# EAGLE design modul_przekaznika (EAGLE 7.7.0)
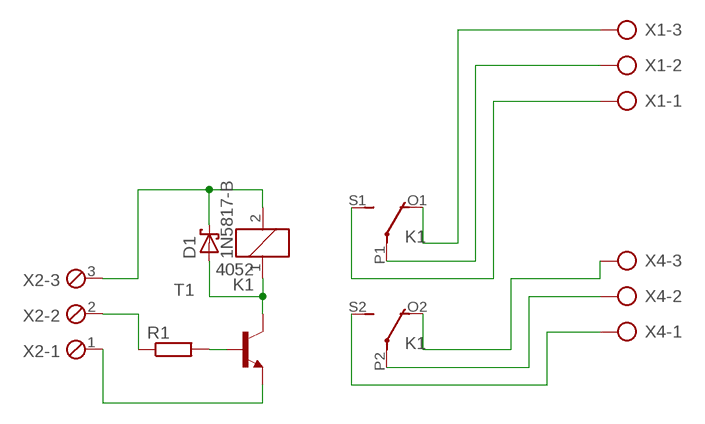
[diagram p0: schematic, sheet 1]

## Parts
D1  1N5817-B  [DO41-7.6]
K1  4052  [F4052]
R1  R-EU_M1206  [M1206]
T1  BC548-NPN-TO92-CBE  [TO92-CBE]
X1  AK500/3  [AK500/3]
X2  MPT3  [3POL254]
X4  AK500/3  [AK500/3]

## Nets
N$1: D1.A K1.1 T1.C
N$2: D1.C K1.2 X2.3
N$3: K1.S2(3:S) X4.1
N$4: K1.P2(3:P) X4.2
N$5: K1.O2(3:O) X4.3
N$6: K1.S1(2:S) X1.1
N$7: K1.P1(2:P) X1.2
N$8: K1.O1(2:O) X1.3
N$9: T1.E X2.1
N$10: R1.1 X2.2
N$11: R1.2 T1.B

## Library data of the parts
D1 = diode:1N581*: 1.0A SCHOTTKY BARRIER RECTIFIER Source: http://www.diodes.com/datasheets/ds23001.pdf
K1 = relay:4052: RELAY 2 x switch, Finder; OC_FARNELL: unknown; OC_NEWARK: unknown
R1 = rcl:R-EU_: RESISTOR, European symbol
T1 = transistor:*-NPN-: NPN Transistror BF959 corrected 2008.03.06
X1 X4 = con-ptr500:AK500/3: CONNECTOR; OC_FARNELL: unknown; OC_NEWARK: unknown
X2 = con-phoenix-254:MPT3: PHOENIX CONNECTOR; OC_FARNELL: unknown; OC_NEWARK: unknown

## Board
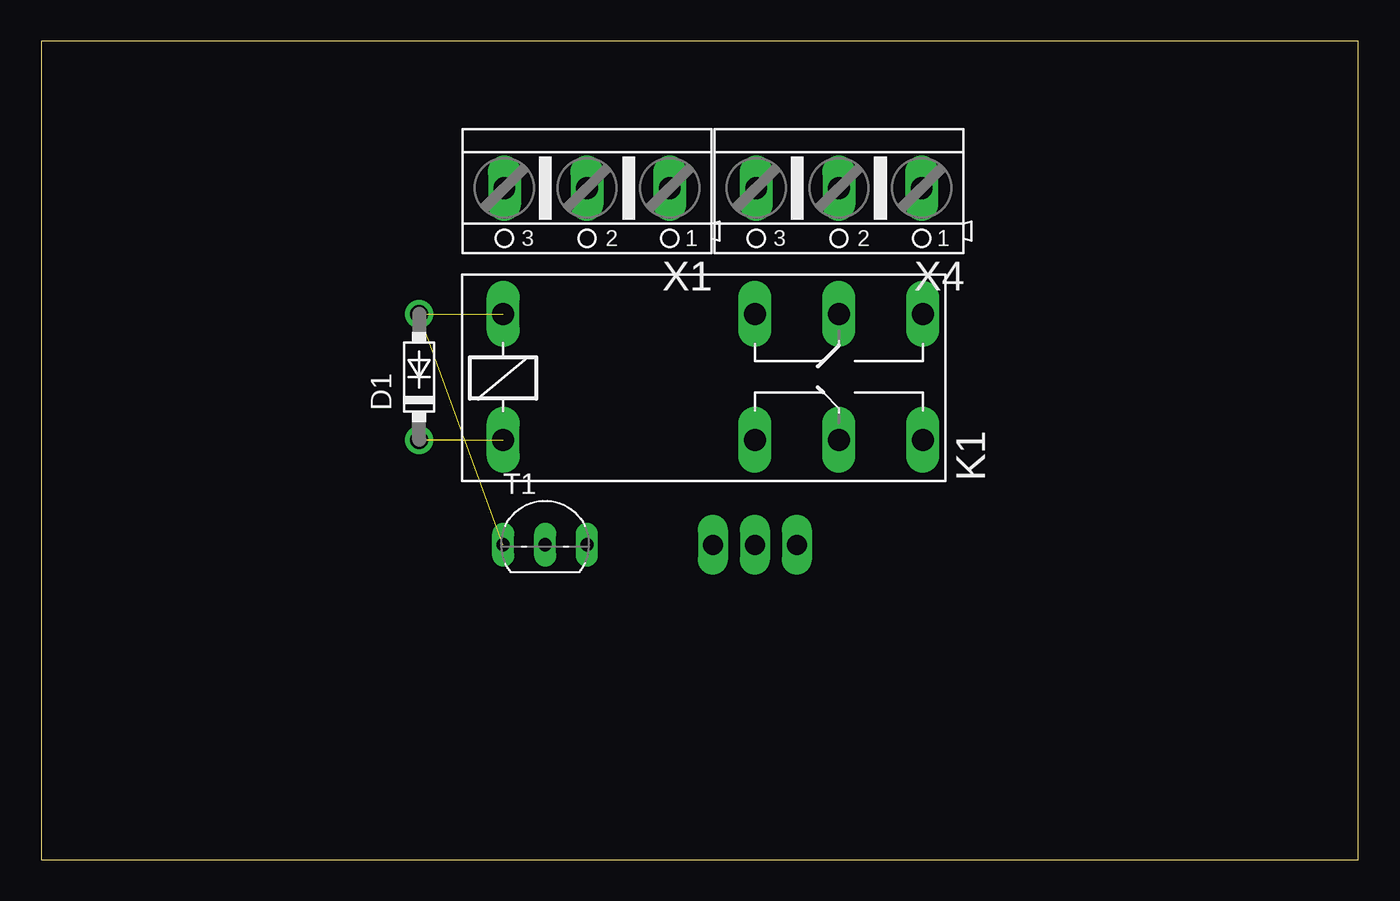
[diagram p1: board, top side]
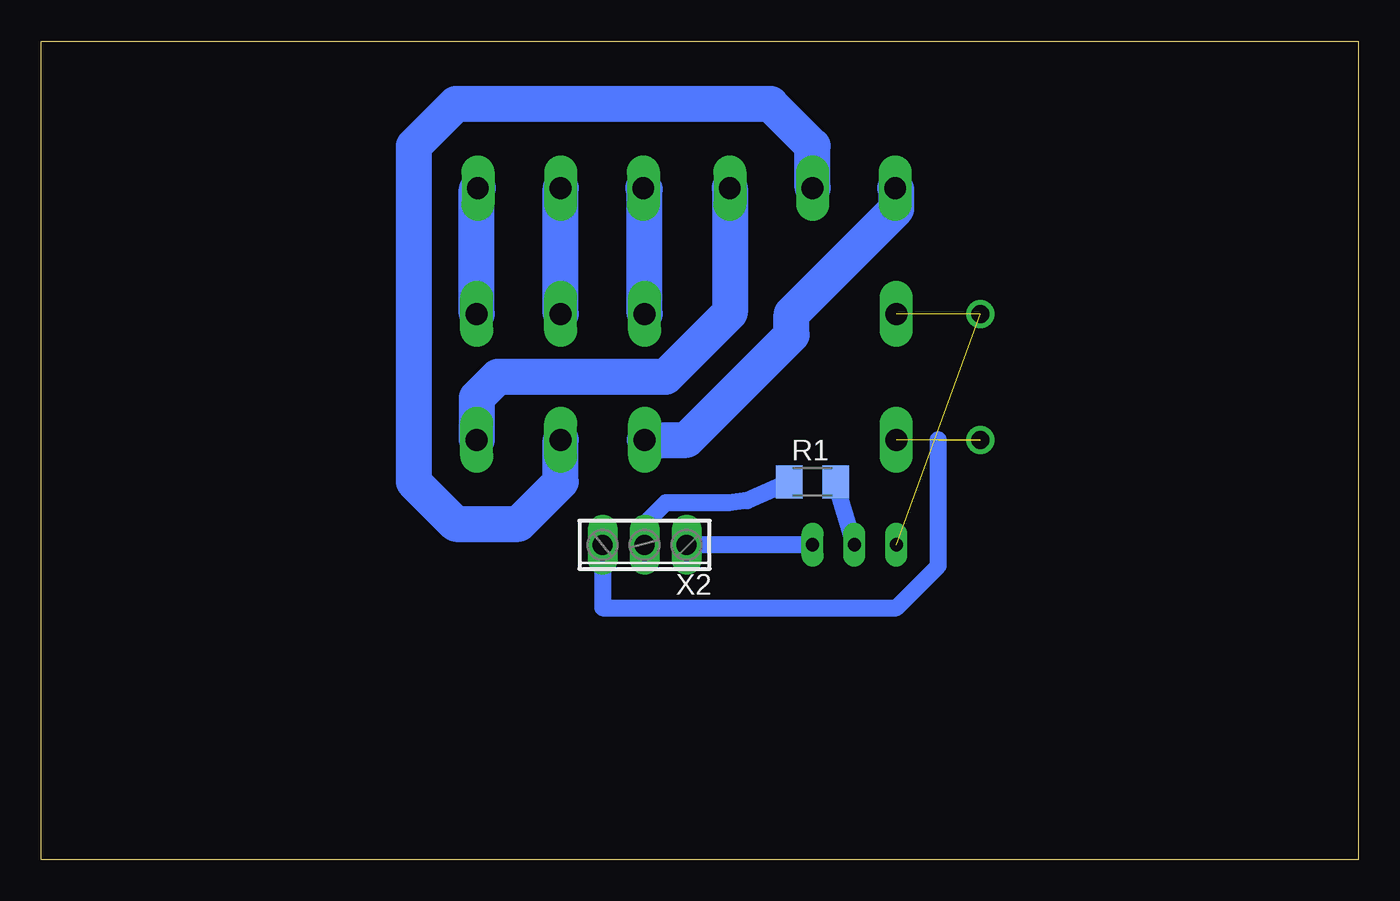
[diagram p2: board, bottom side, seen from below]

Size 79.68 x 49.52 mm. Coordinates in mm from the lower left corner, seen from the top.
Outline: 0,0 79.68,0 79.68,49.52 0,49.52 0,0
Copper layers (1*16): Top 0.035mm / dielectric 1.5mm / Bottom 0.035mm
Design rules "default": minimum track width 10mil, minimum drill 24mil, track to track 8mil, track to pad 8mil, pad to pad 8mil, via to via 8mil, smd to smd 8mil, copper to edge 40mil, drill to drill 8mil, minimum pad ring 10mil, minimum via ring 8mil, stop-mask expansion 4mil, vias tented up to drill 0mil, thermal gap 10mil

### Footprints (pad centres in the part's own frame; a part is rotated, then mirrored left to right if it is on the bottom)
DO41-7.6 = drill 1.1 pad 1.7: A 3.81,0; C -3.81,0
F4052 = drill 1.321 long: 1 -3.81,3.81; 2 -3.81,-3.81; O1 11.43,-3.81; O2 11.43,3.81; P1 16.51,-3.81; P2 16.51,3.81; S1 21.59,-3.81; S2 21.59,3.81
M1206 = smd 1.6 x 2: 1 -1.4,0; 2 1.4,0
TO92-CBE = drill 0.813 long: B 0,0; C -2.54,0; E 2.54,0
AK500/3 = drill 1.321 long: 1 -5.004,0; 2 0,0; 3 5.004,0
3POL254 = drill 1.2 long: 1 -2.54,0; 2 0,0; 3 2.54,0

### Placement (x,y rotation side)
D1  22.86,29.21 90 top
K1  31.75,29.21 0 top
R1  33.02,22.86 0 bottom
T1  30.48,19.05 0 top
X1  33.02,40.64 180 top
X2  43.18,19.05 180 bottom
X4  48.26,40.64 180 top

### Tracks (layer width: path | path; a pad name or v marks a point on that pad's centre or on a via)
N$1  (2 unrouted)
N$2  (2 unrouted)
  Bottom 1.016: X2.3 45.72,15.24 27.94,15.24 25.4,17.78 25.4,25.4
N$3
  Bottom 2.184: K1.S2 53.34,40.56 X4.1
N$4
  Bottom 2.184: K1.P2 X4.2
N$5
  Bottom 2.184: K1.O2 43.18,40.56 X4.3
N$6
  Bottom 2.184: X1.1 38.02,33.1 41.91,29.21 52.07,29.21 53.34,27.94 K1.S1
N$7
  Bottom 2.184: X1.2 33.02,43.18 35.56,45.72 54.61,45.72 57.15,43.18 57.15,22.86 54.61,20.32 50.8,20.32 48.26,22.86 K1.P1
N$8
  Bottom 2.184: K1.O1 40.64,25.4 34.29,31.75 34.29,33.02 27.94,39.37 27.94,40.56 X1.3
N$9
  Bottom 1.016: T1.E X2.1
N$10
  Bottom 1.016: R1.1 36.96,21.72 38.1,21.59 41.91,21.59 43.18,20.32 X2.2
N$11
  Bottom 1.016: T1.B R1.2